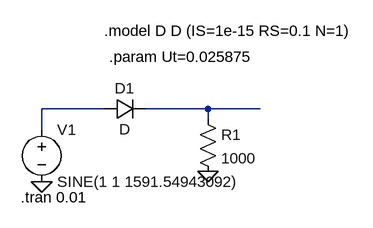
[diagram p0: schematic diode_static.asc]
diode_static.asc, the LTspice schematic file:
Version 4
SHEET 1 880 680
WIRE 208 144 112 144
WIRE 368 144 272 144
WIRE 448 144 368 144
WIRE 368 160 368 144
WIRE 112 176 112 144
FLAG 112 256 0
FLAG 368 240 0
SYMBOL voltage 112 160 R0
WINDOW 123 0 0 Left 0
WINDOW 39 0 0 Left 0
SYMATTR InstName V1
SYMATTR Value SINE(1 1 1591.54943092)
SYMBOL res 352 144 R0
SYMATTR InstName R1
SYMATTR Value 1000
SYMBOL diode 208 160 R270
WINDOW 0 32 32 VTop 2
WINDOW 3 0 32 VBottom 2
SYMATTR InstName D1
TEXT 208 24 Left 2 !.model D D (IS=1e-15 RS=0.1 N=1)
TEXT 80 280 Left 2 !.tran 0.01
TEXT 216 64 Left 2 !.param Ut=0.025875

The netlist it stands for:
* diode_static.asc
V1 N001 0 SINE(1 1 1591.54943092)
R1 N002 0 1000
D1 N001 N002 D
.model D D
.lib standard.dio
.model D D (IS=1e-15 RS=0.1 N=1)
.tran 0.01
.param Ut=0.025875
.backanno
.end